# EAGLE design os20.newenc1 (EAGLE 6.3)
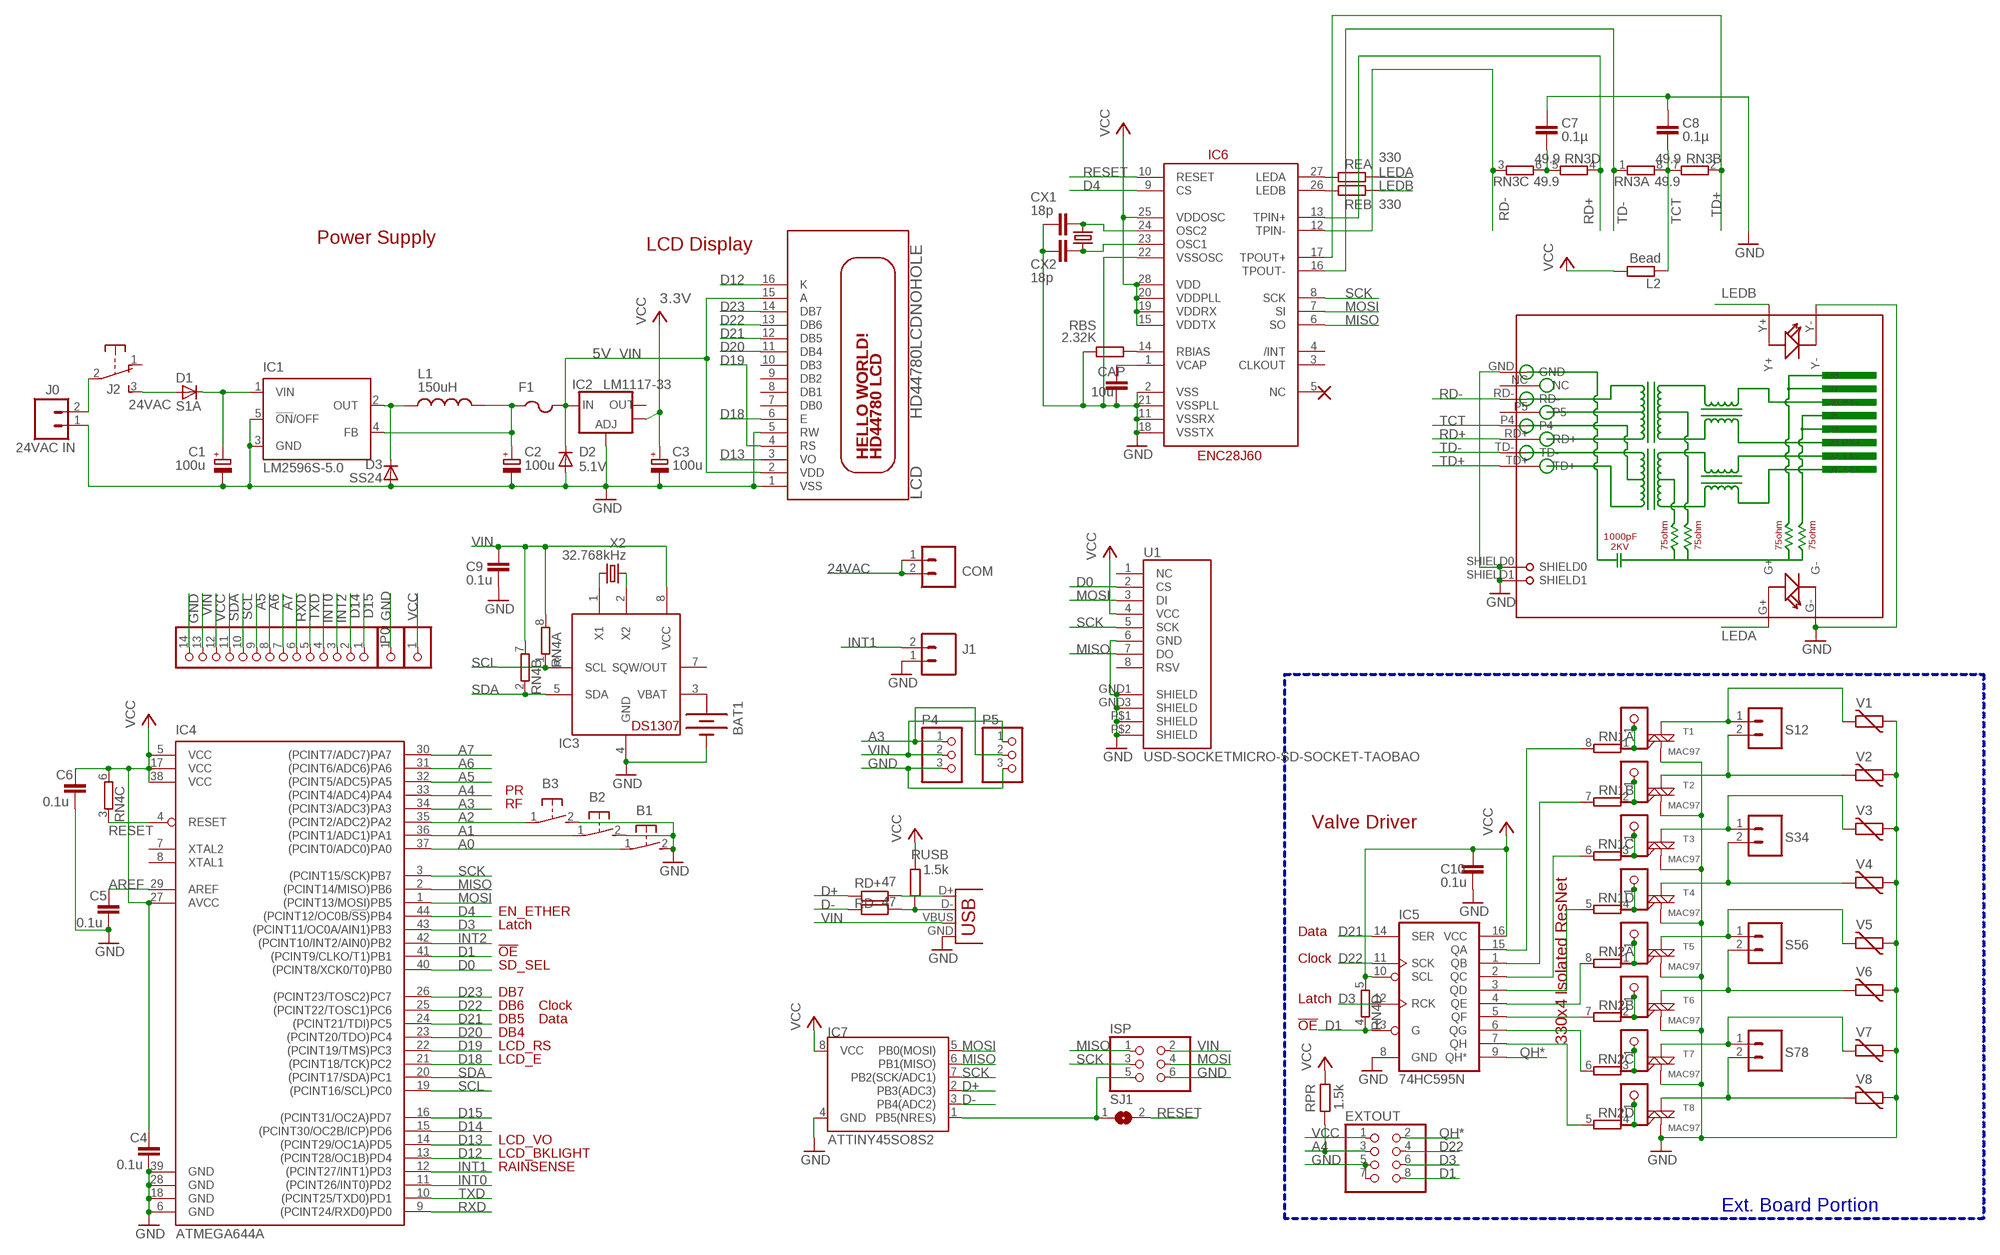
[diagram p0: schematic, sheet 1]

## Parts
B1  31-XX  [B3F-31XX]
B2  31-XX  [B3F-31XX]
B3  31-XX  [B3F-31XX]
BAT1  BATTERYBATTERY_12MM_SMT  [BATTCON_12MM_SMT]
C1  100u  CPOL-EUE3.5-8  [E3,5-8]
C2  100u  CPOL-EUD  [PANASONIC_D]
C3  100u  CPOL-EUD  [PANASONIC_D]
C4  0.1u  C-EUC0805  [C0805]
C5  0.1u  C-EUC0805  [C0805]
C6  0.1u  C-EUC0805  [C0805]
C7  0.1µ  C-EUC0805  [C0805]
C8  0.1µ  C-EUC0805  [C0805]
C9  0.1u  C-EUC0805  [C0805]
C10  0.1u  C-EUC0805  [C0805]
CAP  10u  C-EUC0805  [C0805]
COM  M025MM  [SCREWTERMINAL-5MM-2]
CX1  18p  C-EUC0805  [C0805]
CX2  18p  C-EUC0805  [C0805]
D1  S1A  DIODE-DO-214AC  [DO-214AC]
D2  5.1V  DIODE-MINIMELF  [MINIMELF]
D3  SS24  DIODE-DO-214AC  [DO-214AC]
EXTOUT  PINHD-2X4  [2X04]
F1  PTCFUSE-1812  [1812]
IC1  LM2596S-5.0  LM2596S  [TO263-5]
IC2  LM1117-33  V_REG_LM1117SOT223  [SOT223]
IC3  DS1307  DS1307SOIC  [SO08]
IC4  ATMEGA644A  [TQFP44]
IC5  74HC595N  74LS595D  [SO16]
IC6  ENC28J60  ENC28J60SO28LONG  [SOIC28WLONG]
IC7  ATTINY45SO8S2  [SO8S2]
ISP  PINHD-2X3  [2X03]
J0  24VAC IN  M025MM  [SCREWTERMINAL-5MM-2]
J1  M025MM  [SCREWTERMINAL-5MM-2]
J2  EG1206  [EG1206]
JP2  PINHD-1X1CB  [1X01-CLEANBIG]
JP3  PINHD-1X1CB  [1X01-CLEANBIG]
JP4  PINHD-1X1CB  [1X01-CLEANBIG]
JP5  PINHD-1X1CB  [1X01-CLEANBIG]
JP6  PINHD-1X1CB  [1X01-CLEANBIG]
JP7  PINHD-1X1CB  [1X01-CLEANBIG]
JP8  PINHD-1X1CB  [1X01-CLEANBIG]
JP9  PINHD-1X1CB  [1X01-CLEANBIG]
L1  150uH  INDUCTORPWR  [CDRH125]
L2  Bead  R-EU_R0805  [R0805]
LCD  HD44780LCDNOHOLE  [LCD1602A]
P0  PINHD-1X14-CB  [1X14-CB]
P1  PINHD-1X1CB  [1X01-CLEANBIG]
P2  PINHD-1X1CB  [1X01-CLEANBIG]
P4  PINHD-1X3  [1X03]
P5  PINHD-1X3  [1X03]
RBS  2.32K  R-EU_R0805  [R0805]
RD+  47  R-EU_R0805  [R0805]
RD-  47  R-EU_R0805  [R0805]
REA  330  R-EU_R0805  [R0805]
REB  330  R-EU_R0805  [R0805]
RJ45  HR911105A  [HR911105A]
RN1  4R-NEXB38V  [EXB38V]
RN2  4R-NEXB38V  [EXB38V]
RN3  49.9  4R-NEXB38V  [EXB38V]
RN4  4R-NEXB38V  [EXB38V]
RPR  1.5k  R-EU_R0805  [R0805]
RUSB  1.5k  R-EU_R0805  [R0805]
S12  M025MM  [SCREWTERMINAL-5MM-2]
S34  M025MM  [SCREWTERMINAL-5MM-2]
S56  M025MM  [SCREWTERMINAL-5MM-2]
S78  M025MM  [SCREWTERMINAL-5MM-2]
SJ1  SJ  [SJ]
T1  MAC97  MAC97SOT223  [SOT223]
T2  MAC97  MAC97SOT223  [SOT223]
T3  MAC97  MAC97SOT223  [SOT223]
T4  MAC97  MAC97SOT223  [SOT223]
T5  MAC97  MAC97SOT223  [SOT223]
T6  MAC97  MAC97SOT223  [SOT223]
T7  MAC97  MAC97SOT223  [SOT223]
T8  MAC97  MAC97SOT223  [SOT223]
U1  USD-SOCKETMICRO-SD-SOCKET-TAOBAO  [MICRO-SD-SOCKET-TAOBAO]
USB  USBPTH  [USB-B-PTH]
V1  MOV  VARISTOR-5  [R-5]
V2  MOV  VARISTOR-5  [R-5]
V3  MOV  VARISTOR-5  [R-5]
V4  MOV  VARISTOR-5  [R-5]
V5  MOV  VARISTOR-5  [R-5]
V6  MOV  VARISTOR-5  [R-5]
V7  MOV  VARISTOR-5  [R-5]
V8  MOV  VARISTOR-5  [R-5]
X1  25MHz  CRYSTALHC49US  [HC49US]
X2  32.768kHz  CRYSTALTC26H  [TC26H]

## Nets
24VAC [power]: COM.1 COM.2 D1.A J2.3(S)
A0: B1.1(P) IC4.37((PCINT0/ADC0)PA0)
A1: B2.1(P) IC4.36((PCINT1/ADC1)PA1)
A2: B3.1(P) IC4.35((PCINT2/ADC2)PA2)
A3: IC4.34((PCINT3/ADC3)PA3) P4.1 P5.2
A4: EXTOUT.3 IC4.33((PCINT4/ADC4)PA4) RPR.1
A5: IC4.32((PCINT5/ADC5)PA5) P0.9
A6: IC4.31((PCINT6/ADC6)PA6) P0.8
A7: IC4.30((PCINT7/ADC7)PA7) P0.7
AREF: C5.1 IC4.29(AREF)
D0: IC4.40((PCINT8/XCK0/T0)PB0) U1.2(CS)
D1: EXTOUT.8 IC4.41((PCINT9/CLKO/T1)PB1) IC5.13(G) RN4.4
D3: EXTOUT.6 IC4.43((PCINT11/OC0A/AIN1)PB3) IC5.12(RCK)
D4: IC4.44((PCINT12/OC0B/!SS!)PB4) IC6.9(CS)
D12: IC4.13((PCINT28/OC1B)PD4) LCD.16(K)
D13: IC4.14((PCINT29/OC1A)PD5) LCD.3(VO)
D14: IC4.15((PCINT30/OC2B/ICP)PD6) P0.2
D15: IC4.16((PCINT31/OC2A)PD7) P0.1
D18: IC4.21((PCINT18/TCK)PC2) LCD.6(E)
D19: IC4.22((PCINT19/TMS)PC3) LCD.4(RS)
D20: IC4.23((PCINT20/TDO)PC4) LCD.11(DB4)
D21: IC4.24((PCINT21/TDI)PC5) IC5.14(SER) LCD.12(DB5)
D22: EXTOUT.4 IC4.25((PCINT22/TOSC1)PC6) IC5.11(SCK) LCD.13(DB6)
D23: IC4.26((PCINT23/TOSC2)PC7) LCD.14(DB7)
D+: IC7.2(PB3(ADC3)) RD+.1
D-: IC7.3(PB4(ADC2)) RD-.1
GND: B1.2(S) B2.2(S) B3.2(S) BAT1.P$1(-) C1.- C2.- C3.- C4.2 C5.2 C6.2 C7.1 C8.1 C9.2 C10.2 CAP.2 CX1.2 CX2.2 D2.A D3.A EXTOUT.5 EXTOUT.7 IC1.3(GND) IC1.5(!ON!/OFF) IC2.1(ADJ) IC3.4(GND) IC4.6(GND) IC4.18(GND) IC4.28(GND) IC4.39(GND) IC5.8(GND) IC6.2(VSS) IC6.11(VSSRX) IC6.18(VSSTX) IC6.21(VSSPLL) IC6.22(VSSOSC) IC7.4(GND) ISP.6 J0.1 J1.1 LCD.1(VSS) LCD.5(RW) P0.14 P1.1 P4.3 P5.3 RBS.1 RJ45.G- RJ45.GND RJ45.SHIELD0 RJ45.SHIELD1 RJ45.Y- T1.1(M1) T2.1(M1) T3.1(M1) T4.1(M1) T5.1(M1) T6.1(M1) T7.1(M1) T8.1(M1) U1.6(GND) U1.GND1(SHIELD) U1.GND3(SHIELD) U1.P$1(SHIELD) U1.P$2(SHIELD) USB.GND V1.1 V2.1 V3.1 V4.1 V5.1 V6.1 V7.1 V8.1
INT0: IC4.11((PCINT26/INT0)PD2) P0.4
INT1: IC4.12((PCINT27/INT1)PD3) J1.2
INT2: IC4.42((PCINT10/INT2/AIN0)PB2) P0.3
LEDA: REA.2 RJ45.G+
LEDB: REB.2 RJ45.Y+
MISO: IC4.2((PCINT14/MISO)PB6) IC6.6(SO) IC7.6(PB1(MISO)) ISP.1 U1.7(DO)
MOSI: IC4.1((PCINT13/MOSI)PB5) IC6.7(SI) IC7.5(PB0(MOSI)) ISP.4 U1.3(DI)
N$1 [power]: C1.+ D1.C IC1.1(VIN)
N$2 [power]: C2.+ F1.1 IC1.4(FB) L1.2
N$3: JP2.1 RN1.1 T1.3(G)
N$4: IC5.5(QF) RN2.7
N$5: IC5.6(QG) RN2.6
N$6 [power]: J0.2 J2.2(P)
N$7: IC5.7(QH) RN2.5
N$8: IC3.1(X1) X2.2
N$9 [power]: D3.C IC1.2(OUT) L1.1
N$10: IC5.4(QE) RN2.8
N$11: IC5.3(QD) RN1.5
N$12: IC5.2(QC) RN1.6
N$13: IC5.1(QB) RN1.7
N$14: IC5.15(QA) RN1.8
N$15: JP3.1 RN1.2 T2.3(G)
N$16 [power]: S12.1 T1.4(M2) V1.2
N$17 [power]: S12.2 T2.4(M2) V2.2
N$18 [power]: S34.1 T3.4(M2) V3.2
N$19: JP4.1 RN1.3 T3.3(G)
N$20 [power]: S34.2 T4.4(M2) V4.2
N$21: JP5.1 RN1.4 T4.3(G)
N$22 [power]: S56.1 T5.4(M2) V5.2
N$23 [power]: S56.2 T6.4(M2) V6.2
N$24 [power]: S78.1 T7.4(M2) V7.2
N$25 [power]: S78.2 T8.4(M2) V8.2
N$26: JP6.1 RN2.1 T5.3(G)
N$27: JP7.1 RN2.2 T6.3(G)
N$28: JP8.1 RN2.3 T7.3(G)
N$29: JP9.1 RN2.4 T8.3(G)
N$30: IC3.2(X2) X2.1
N$34: IC6.27(LEDA) REA.1
N$36: BAT1.P$2(+) IC3.3(VBAT)
N$37: IC6.26(LEDB) REB.1
N$38: RD+.2 USB.D+
N$39: CAP.1 IC6.1(VCAP)
N$41: CX1.1 IC6.24(OSC2) X1.2
N$42: CX2.1 IC6.23(OSC1) X1.1
N$45: RD-.2 RUSB.1 USB.D-
N$52: IC7.1(PB5(NRES)) ISP.5 SJ1.1
N$54: C7.2 RN3.5 RN3.6
N$59: IC6.14(RBIAS) RBS.2
QH*: EXTOUT.2 IC5.9(QH*)
RD+: IC6.13(TPIN+) RJ45.RD+ RN3.4
RD-: IC6.12(TPIN-) RJ45.RD- RN3.3
RESET: IC4.4(RESET) IC6.10(RESET) RN4.3 SJ1.2
RXD: IC4.9((PCINT24/RXD0)PD0) P0.6
SCK: IC4.3((PCINT15/SCK)PB7) IC6.8(SCK) IC7.7(PB2(SCK/ADC1)) ISP.3 U1.5(SCK)
SCL: IC3.6(SCL) IC4.19((PCINT16/SCL)PC0) P0.10 RN4.1
SDA: IC3.5(SDA) IC4.20((PCINT17/SDA)PC1) P0.11 RN4.2
TCT: C8.2 L2.1 RJ45.P4 RN3.7 RN3.8
TD+: IC6.17(TPOUT+) RJ45.TD+ RN3.2
TD-: IC6.16(TPOUT-) RJ45.TD- RN3.1
TXD: IC4.10((PCINT25/TXD0)PD1) P0.5
VCC: C3.+ C4.1 C6.1 C10.1 EXTOUT.1 IC2.4(OUT) IC4.5(VCC) IC4.17(VCC) IC4.27(AVCC) IC4.38(VCC) IC5.10(SCL) IC5.16(VCC) IC6.15(VDDTX) IC6.19(VDDRX) IC6.20(VDDPLL) IC6.25(VDDOSC) IC6.28(VDD) IC7.8(VCC) L2.2 P0.12 P2.1 RN4.5 RN4.6 RPR.2 RUSB.2 U1.4(VCC)
VIN [power]: C9.1 D2.C F1.2 IC2.3(IN) IC3.8(VCC) ISP.2 LCD.2(VDD) LCD.15(A) P0.13 P4.2 P5.1 RN4.7 RN4.8 USB.VBUS
Unconnected: IC2.2(OUT) IC3.7(SQW/OUT) IC4.7(XTAL2) IC4.8(XTAL1) IC6.3(CLKOUT) IC6.4(/INT) IC6.5(NC) J2.1(O) LCD.7(DB0) LCD.8(DB1) LCD.9(DB2) LCD.10(DB3) RJ45.NC RJ45.P5 U1.1(NC) U1.8(RSV)

## Buses
B$1

## Notes on the sheet
- Power Supply
- LCD Display
- 3.3V
- 5V
- PR
- RF
- Valve Driver
- EN_ETHER
- Latch
- Data
- !OE
- Clock
- SD_SEL
- DB7
- Latch
- DB6 | Clock
- DB5 | Data
- !OE
- DB4
- 330x4 Isolated ResNet
- LCD_RS
- LCD_E
- LCD_VO
- LCD_BKLIGHT
- RAINSENSE
- Ext. Board Portion

## Library data of the parts
B1-B3 = adafruit:31-XX: OMRON SWITCH Now with beefier pads!
BAT1 = SparkFunNew:BATTERY: Battery Holders Various common sizes : AA, AAA, 20mm coin cell and 12mm coin cell.
C1-C3 = resistor:CPOL-EU: POLARIZED CAPACITOR, European symbol
C4-C6 C9 C10 = rcl:C-EU: CAPACITOR, European symbol
C7 C8 CAP CX1 CX2 = resistor:C-EU: CAPACITOR, European symbol
COM J0 J1 S12 S34 S56 S78 = SparkFun:M02: Header 2 Standard 2-pin 0.1" header. Use with straight break away headers (SKU : PRT-00116), right angle break away headers (PRT-00553), swiss pins (PRT-00743), machine pins (PRT-00117), and female headers (PRT-00115). Molex polarized connector foot print use with SKU : PRT-08233 with associated crimp pins and housings.
D1-D3 = diode:DIODE-: DIODE
EXTOUT = pinhead:PINHD-2X4: PIN HEADER
F1 = adafruit:PTCFUSE: PTC fuses, resettable thermistors
IC1 = national-semiconductor:LM2596: SIMPLE SWITCHER® Power Converter 150 kHz 3A Step-Down Voltage Regulator Source: http://www.national.com/ds/LM/LM2596.pdf; MF: NATIONAL SEMICONDUCTOR; MPN: LM2596S-ADJ/NOPB; OC_FARNELL: 9494367; OC_NEWARK: 41K3842
IC2 = SparkFun:V_REG_LM1117: Voltage Regulator LM1117 Standard adjustable voltage regulator but in SMD form. Spark Fun Electronics SKU : COM-00595
IC3 = adafruit:DS1307: DS1307 Real time clock (RTC) with battery backup ability. Talk to it via i2c
IC4 = atmel:ATMEGA644: 8-bit Microcontroller with 64K Bytes In-System Programmable Flash Source: http://www.atmel.com/dyn/resources/prod_documents/doc2593.pdf; MPN: ATMEGA644PV-10AU; OC_FARNELL: 1455123; OC_NEWARK: 58M3748
IC5 = SparkFun:74*595: 8-bit SHIFT REGISTER, output latch
IC6 = SparkFun:ENC28J60
IC7 = SparkFun:ATTINY45: Atmel ATTiny45
ISP = pinhead:PINHD-2X3: PIN HEADER
J2 = adafruit:EG1206
JP2-JP9 P1 P2 = adafruit:PINHD-1X1: Pin header 1x1 for 0.1" spacing With round pins
L1 = SparkFunNew:INDUCTOR: Inductors Basic Inductor/Choke - 0603 and 1206. Footprints are not proven and vary greatly between part numbers.
L2 RBS RD+ RD- REA REB RPR RUSB = rcl:R-EU_: RESISTOR, European symbol
LCD = adafruit:HD44780LCD: HD44780 LCD Standard character type LCDs, available in sizes from 8x1 to 40x4!
P0 = adafruit:PINHD-1X14: PIN HEADER
P4 P5 = pinhead:PINHD-1X3: PIN HEADER
RJ45 = CONNECTER:HR911105A
RN1-RN4 = resistor-dil:4R-N: Array Chip Resistor Source: RS Component / Phycomp; OC_FARNELL: unknown; OC_NEWARK: unknown
SJ1 = jumper:SJ: SMD solder JUMPER
T1-T8 = SparkFun:MAC97: MAC97 Triac http://www.onsemi.com/pub_link/Collateral/MAC97-D.PDF
U1 = SparkFunNew:USD-SOCKET: microSD Socket Push-push type uSD socket. Schematic element and footprint production proven. Spark Fun Electronics SKU : PRT-00127. tDoc lines correctly indicate media card edge positions when inserting (unlocked, locked, depressed).
USB = SparkFunNew:USB: USB Connectors USB-B-PTH is fully proven SKU : PRT-00139 USB-miniB is fully proven SKU : PRT-00587 USB-A-PCB is untested. USB-A-H is throughly reviewed, but untested. Spark Fun Electronics SKU : PRT-00437 USB-B-SMT is throughly reviewed, but untested. Needs silkscreen touching up. USB-A-S has not been used/tested USB-MB-H has not been used/tested
V1-V8 = varistor:VARISTOR: VARISTOR
X1 = SparkFun:CRYSTAL: Crystals Various standard crystals. Proven footprints. Spark Fun Electronics SKU : COM-00534
X2 = crystal:CRYSTAL: CRYSTAL; OC_FARNELL: unknown; OC_NEWARK: unknown

## Net classes
0 default: width 0.305 mm, clearance 0.203 mm
1 power: width 0.61 mm, clearance 0.203 mm

## Board
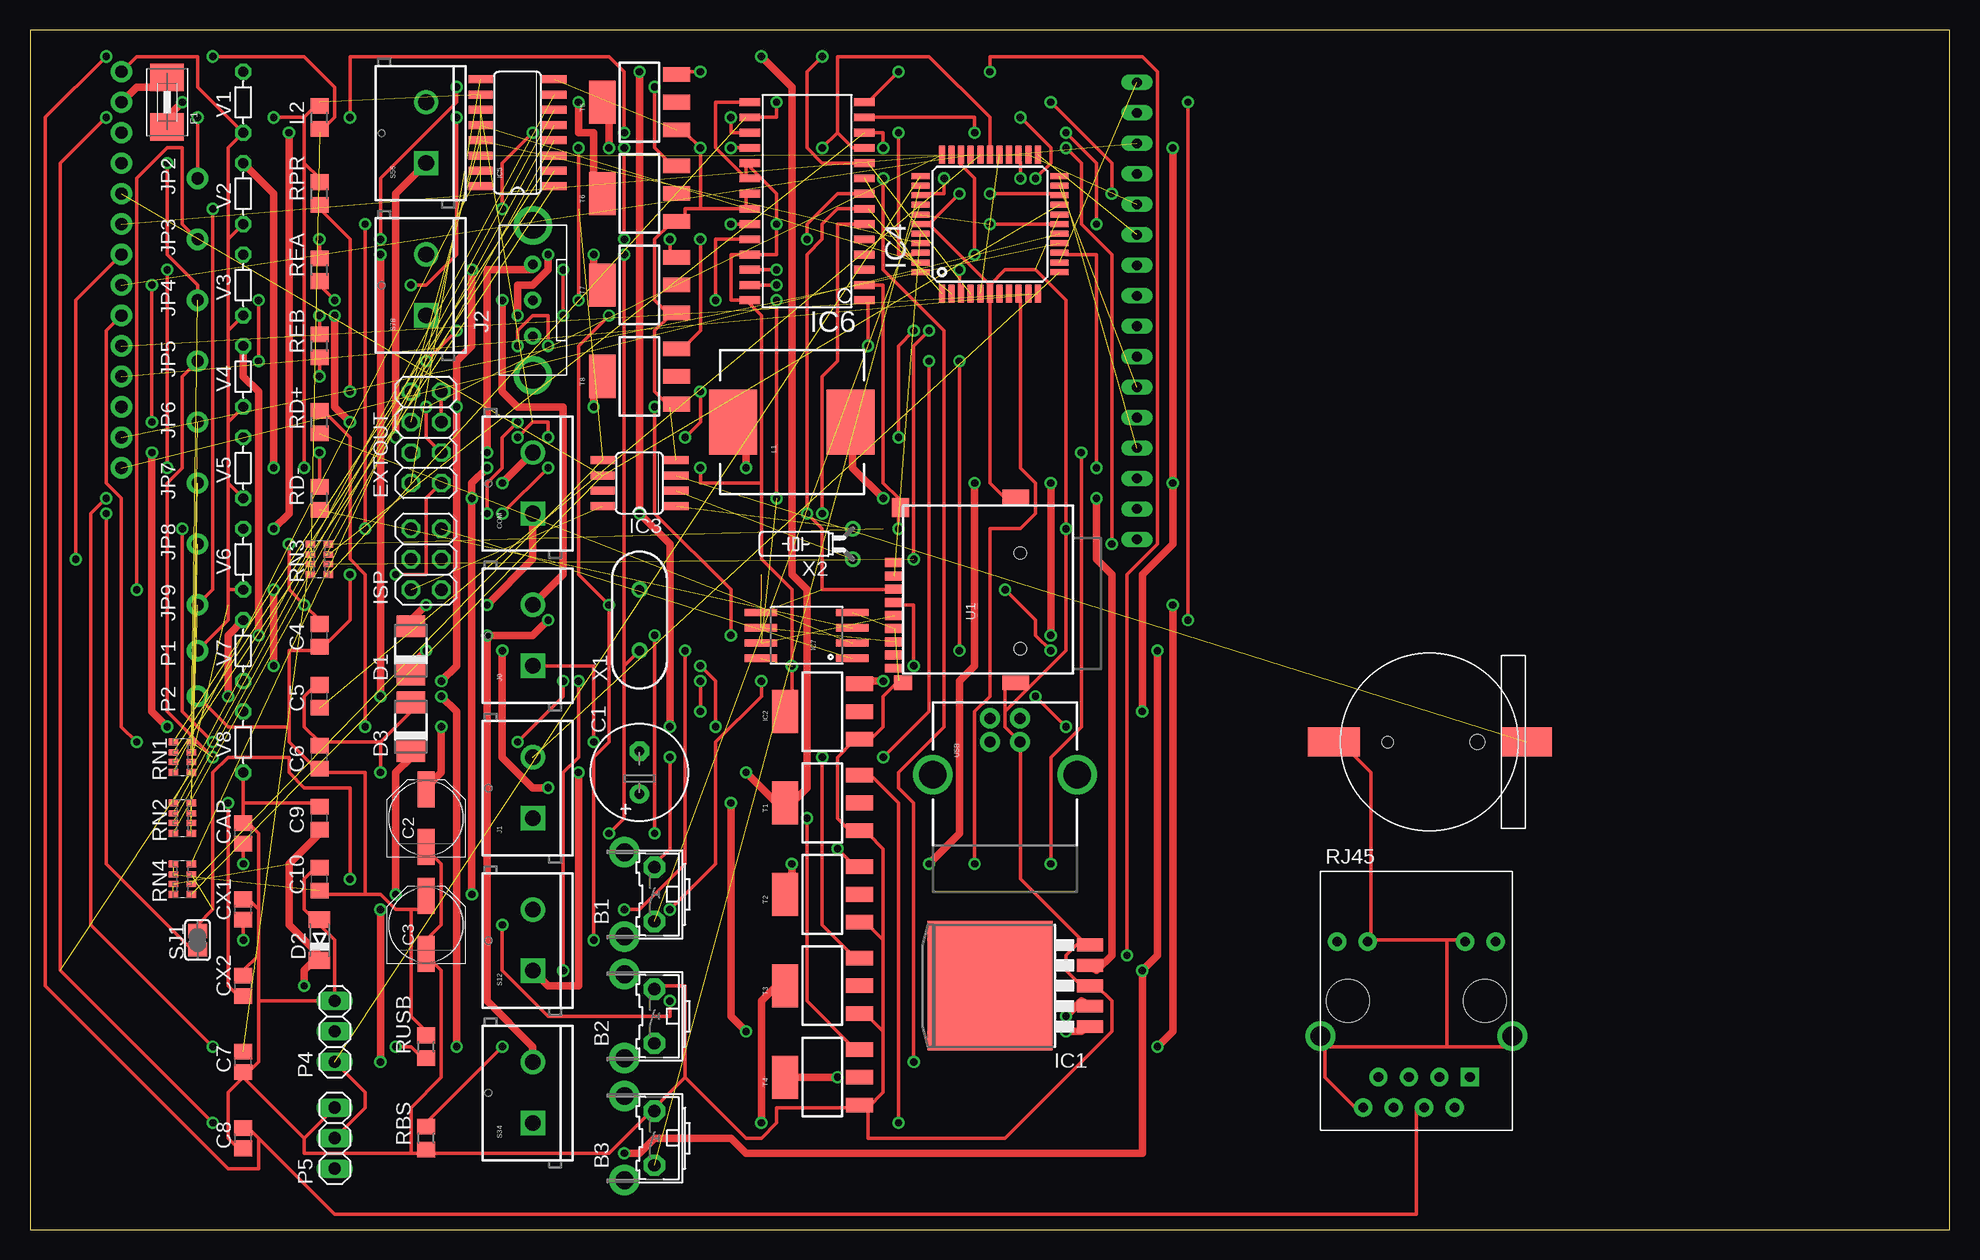
[diagram p1: board, top side]
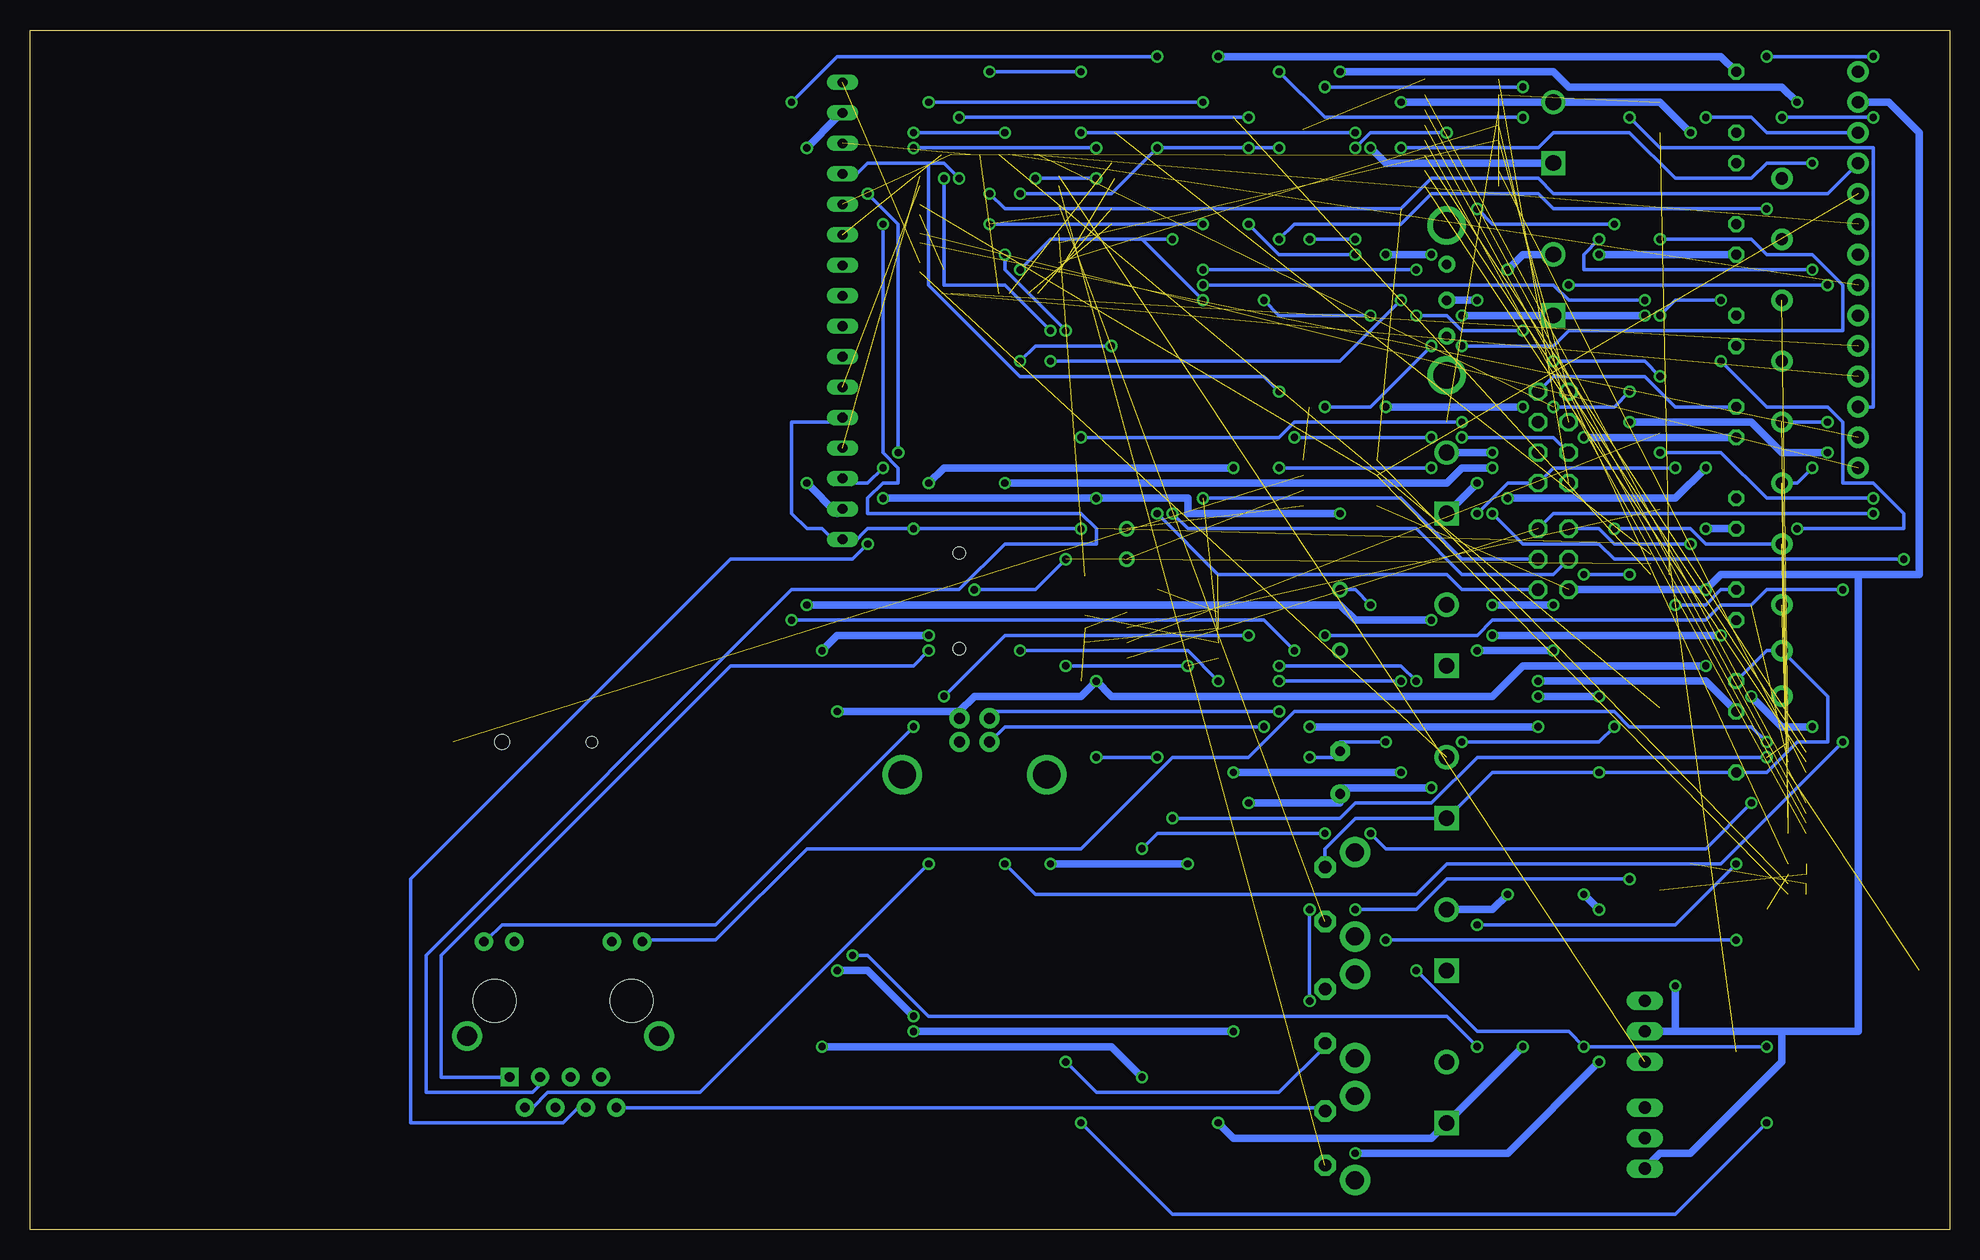
[diagram p2: board, bottom side, seen from below]

Size 160 x 100 mm. Coordinates in mm from the lower left corner, seen from the top.
Outline: 0,0 160,0 160,100 0,100 0,0
Copper layers (1*16): Top 0.035mm / dielectric 1.5mm / Bottom 0.035mm
Design rules "default": minimum track width 10mil, minimum drill 24mil, track to track 8mil, track to pad 8mil, pad to pad 8mil, via to via 8mil, smd to smd 8mil, copper to edge 40mil, drill to drill 8mil, minimum pad ring 10mil, minimum via ring 8mil, stop-mask expansion 4mil, vias tented up to drill 0mil, thermal gap 10mil

### Footprints (pad centres in the part's own frame; a part is rotated, then mirrored left to right if it is on the bottom)
B3F-31XX = drill 1.016 pad 1.778 octagon: 1 -2.261,-1.245; 2 2.261,-1.245 | drill 1.499 pad 2.54: 3 -3.505,1.245; 4 3.505,1.245
BATTCON_12MM_SMT = smd 2.4 x 4.3: P$1 0,11.96 | smd 2.4 x 4.2: P$2 0,-4.1 | hole 0.95: 0,7.5 | hole 1.25: 0,0
E3,5-8 = drill 0.813 pad 1.6: + -1.778,0 | drill 0.813 pad 1.6 octagon: - 1.778,0
PANASONIC_D = smd 3 x 1.4: + 2.4,0; - -2.4,0
C0805 = smd 1.3 x 1.5: 1 -0.95,0; 2 0.95,0
C0805' = smd 1.3 x 1.5: 1 -0.85,0; 2 0.85,0
SCREWTERMINAL-5MM-2 = drill 1.3 pad 2.032 square: 1 0,0 | drill 1.3 pad 2.032: 2 5.08,0
DO-214AC = smd 1.8 x 2.4: A 2.025,0; C -2.025,0
MINIMELF = smd 1.4 x 1.8: A 1.7,0; C -1.7,0
2X04 = drill 1.016 octagon: 1 -3.81,-1.27; 2 -3.81,1.27; 3 -1.27,-1.27; 4 -1.27,1.27; 5 1.27,-1.27; 6 1.27,1.27; 7 3.81,-1.27; 8 3.81,1.27
1812 = smd 2.286 x 2.794: 1 -2.046,0; 2 2.046,0
TO263-5 = smd 1.067 x 2.159: 1 -3.404,-5.791; 2 -1.702,-5.791; 3 0,-5.791; 4 1.702,-5.791; 5 3.404,-5.791 | smd 10.8 x 10.41: 6 0,2.54
SOT223 = smd 1.219 x 2.235: 1 -2.311,-3.099; 2 0,-3.099; 3 2.311,-3.099 | smd 3.6 x 2.2: 4 0,3.099
SO08 = smd 0.66 x 2.032: 1 -1.905,-3.073; 2 -0.635,-3.073; 3 0.635,-3.073; 4 1.905,-3.073; 5 1.905,3.073; 6 0.635,3.073; 7 -0.635,3.073; 8 -1.905,3.073
TQFP44 = smd 1.5 x 0.5: 1 -5.8,4; 2 -5.8,3.2; 3 -5.8,2.4; 4 -5.8,1.6; 5 -5.8,0.8; 6 -5.8,0; 7 -5.8,-0.8; 8 -5.8,-1.6; 9 -5.8,-2.4; 10 -5.8,-3.2; 11 -5.8,-4; 23 5.8,-4; 24 5.8,-3.2; 25 5.8,-2.4; 26 5.8,-1.6; 27 5.8,-0.8; 28 5.8,0; 29 5.8,0.8; 30 5.8,1.6; 31 5.8,2.4; 32 5.8,3.2; 33 5.8,4 | smd 0.5 x 1.5: 12 -4,-5.8; 13 -3.2,-5.8; 14 -2.4,-5.8; 15 -1.6,-5.8; 16 -0.8,-5.8; 17 0,-5.8; 18 0.8,-5.8; 19 1.6,-5.8; 20 2.4,-5.8; 21 3.2,-5.8; 22 4,-5.8; 34 4,5.8; 35 3.2,5.8; 36 2.4,5.8; 37 1.6,5.8; 38 0.8,5.8; 39 0,5.8; 40 -0.8,5.8; 41 -1.6,5.8; 42 -2.4,5.8; 43 -3.2,5.8; 44 -4,5.8
SO16 = smd 0.66 x 2.032: 1 -4.445,-3.073; 2 -3.175,-3.073; 3 -1.905,-3.073; 4 -0.635,-3.073; 5 0.635,-3.073; 6 1.905,-3.073; 7 3.175,-3.073; 8 4.445,-3.073; 9 4.445,3.073; 10 3.175,3.073; 11 1.905,3.073; 12 0.635,3.073; 13 -0.635,3.073; 14 -1.905,3.073; 15 -3.175,3.073; 16 -4.445,3.073
SOIC28WLONG = smd 0.65 x 1.7: 1 -8.89,-4.78; 2 -7.62,-4.78; 3 -6.35,-4.78; 4 -5.08,-4.78; 5 -3.81,-4.78; 6 -2.54,-4.78; 7 -1.27,-4.78; 8 0,-4.78; 9 1.27,-4.78; 10 2.54,-4.78; 11 3.81,-4.78; 12 5.08,-4.78; 13 6.35,-4.78; 14 7.62,-4.78; 15 7.62,4.78; 16 6.35,4.78; 17 5.08,4.78; 18 3.81,4.78; 19 2.54,4.78; 20 1.27,4.78; 21 0,4.78; 22 -1.27,4.78; 23 -2.54,4.78; 24 -3.81,4.78; 25 -5.08,4.78; 26 -6.35,4.78; 27 -7.62,4.78; 28 -8.89,4.78
SO8S2 = smd 0.61 x 2.7: 1 -1.905,-3.778; 2 -0.635,-3.778; 3 0.635,-3.778; 4 1.905,-3.778; 5 1.905,3.853; 6 0.635,3.853; 7 -0.635,3.853; 8 -1.905,3.853
2X03 = drill 1.016 octagon: 1 -2.54,-1.27; 2 -2.54,1.27; 3 0,-1.27; 4 0,1.27; 5 2.54,-1.27; 6 2.54,1.27
EG1206 = drill 0.8 pad 1.422: 1 -3,0; 2 0,0; 3 3,0 | drill 2.2: MT1 -6.25,0; MT2 6.25,0
1X01-CLEANBIG = drill 1.016 pad 1.778: 1 0,0
CDRH125 = smd 5.4 x 4: 1 0,4.9; 2 0,-4.9
R0805 = smd 1.3 x 1.5: 1 -0.95,0; 2 0.95,0
LCD1602A = drill 0.8 long: 1 8,33.46; 2 10.54,33.46; 3 13.08,33.46; 4 15.62,33.46; 5 18.16,33.46; 6 20.7,33.46; 7 23.24,33.46; 8 25.78,33.46; 9 28.32,33.46; 10 30.86,33.46; 11 33.4,33.46; 12 35.94,33.46; 13 38.48,33.46; 14 41.02,33.46; 15 43.56,33.46; 16 46.1,33.46
1X14-CB = drill 1.016 pad 1.778: 1 -16.51,0; 2 -13.97,0; 3 -11.43,0; 4 -8.89,0; 5 -6.35,0; 6 -3.81,0; 7 -1.27,0; 8 1.27,0; 9 3.81,0; 10 6.35,0; 11 8.89,0; 12 11.43,0; 13 13.97,0; 14 16.51,0
1X03 = drill 1.016 long: 1 -2.54,0; 2 0,0; 3 2.54,0
HR911105A = drill 0.813 pad 1.524: G+ 4.953,-6.604; G- 4.953,-4.064; GND -8.89,4.445; NC -6.35,3.175; P4 -8.89,-0.635; P5 -6.35,0.635; RD+ -6.35,-1.905; RD- -8.89,1.905; TD- -8.89,-3.175; Y+ 4.953,6.604; Y- 4.953,4.064 | drill 1.651 pad 2.159: SHIELD0 -2.921,8.001; SHIELD1 -2.921,-8.001 | drill 0.813 pad 1.524 square: TD+ -6.35,-4.445 | hole 3.556: 0,-5.715; 0,5.715
EXB38V = smd 0.6 x 0.8: 1 -1.275,-0.75; 4 1.275,-0.75; 5 1.275,0.75; 8 -1.275,0.75 | smd 0.5 x 0.8: 2 -0.4,-0.75; 3 0.4,-0.75; 6 0.4,0.75; 7 -0.4,0.75
SJ = smd 1.168 x 1.6: 1 -0.762,0; 2 0.762,0
MICRO-SD-SOCKET-TAOBAO = smd 0.75 x 1.6: 1 2.25,10.5; 2 1.15,10.5; 3 0.05,10.5; 4 -1.05,10.5; 5 -2.15,10.5; 6 -3.25,10.5; 7 -4.35,10.5; 8 -5.45,10.5 | smd 0.7 x 1.6: CD -6.55,10.5 | smd 1.2 x 1.5: GND1 -7.75,9.8 | smd 1.6 x 1.4: GND3 6.85,10 | smd 1.2 x 2.2: P$1 7.75,0.4; P$2 -7.75,0.4 | hole 1: 3.05,0; -4.93,0
USB-B-PTH = drill 0.914 pad 1.676: D+ 0,1.25; D- 1.981,1.25; GND 0,-1.25; VBUS 1.981,-1.25 | drill 2.286: S1 -2.718,-6.02; S2 -2.718,6.02
R-5 = drill 0.813 octagon: 1 -2.54,0; 2 2.54,0
HC49US = drill 0.813: 1 -2.54,0; 2 2.54,0
TC26H = drill 0.813: 1 -1.27,0; 2 1.27,0

### Placement (x,y rotation side)
B1  50.8,27.94 90 top
B2  50.8,17.78 90 top
B3  50.8,7.62 90 top
BAT1  120.65,40.64 90 top
C1  50.8,38.1 90 top
C2  33.02,34.29 90 top
C3  33.02,25.4 90 top
C4  24.13,49.53 90 top
C5  24.13,44.45 90 top
C6  24.13,39.37 90 top
C7  0.1µ  [C0805']  17.78,13.97 90 top
C8  0.1µ  [C0805']  17.78,7.62 90 top
C9  24.13,34.29 90 top
C10  24.13,29.21 90 top
CAP  10u  [C0805']  17.78,33.02 90 top
COM  41.91,59.69 90 top
CX1  18p  [C0805']  17.78,26.67 90 top
CX2  18p  [C0805']  17.78,20.32 90 top
D1  31.75,48.26 90 top
D2  24.13,24.13 90 top
D3  31.75,41.91 90 top
EXTOUT  33.02,66.04 90 top
F1  11.43,93.98 90 top
IC1  82.55,20.32 90 top
IC2  66.04,43.18 90 top
IC3  50.8,62.23 90 top
IC4  80.01,83.82 90 top
IC5  40.64,91.44 90 top
IC6  64.77,86.36 90 top
IC7  64.77,49.53 90 top
ISP  33.02,55.88 90 top
J0  41.91,46.99 90 top
J1  41.91,34.29 90 top
J2  41.91,77.47 90 top
JP2  13.97,87.63 90 top
JP3  13.97,82.55 90 top
JP4  13.97,77.47 90 top
JP5  13.97,72.39 90 top
JP6  13.97,67.31 90 top
JP7  13.97,62.23 90 top
JP8  13.97,57.15 90 top
JP9  13.97,52.07 90 top
L1  63.5,67.31 90 top
L2  24.13,92.71 90 top
LCD  125.73,49.53 90 top
P0  7.62,80.01 90 top
P1  13.97,48.26 90 top
P2  13.97,44.45 90 top
P4  25.4,16.51 90 top
P5  25.4,7.62 90 top
RBS  33.02,7.62 90 top
RD+  24.13,67.31 90 top
RD-  24.13,60.96 90 top
REA  24.13,80.01 90 top
REB  24.13,73.66 90 top
RJ45  115.57,19.05 90 top
RN1  12.7,39.37 90 top
RN2  12.7,34.29 90 top
RN3  24.13,55.88 90 top
RN4  12.7,29.21 90 top
RPR  24.13,86.36 90 top
RUSB  33.02,15.24 90 top
S12  41.91,21.59 90 top
S34  41.91,8.89 90 top
S56  33.02,88.9 90 top
S78  33.02,76.2 90 top
SJ1  13.97,24.13 90 top
T1  66.04,35.56 90 top
T2  66.04,27.94 90 top
T3  66.04,20.32 90 top
T4  66.04,12.7 90 top
T5  50.8,93.98 90 top
T6  50.8,86.36 90 top
T7  50.8,78.74 90 top
T8  50.8,71.12 90 top
U1  82.55,53.34 90 top
USB  81.28,40.64 90 top
V1  17.78,93.98 90 top
V2  17.78,86.36 90 top
V3  17.78,78.74 90 top
V4  17.78,71.12 90 top
V5  17.78,63.5 90 top
V6  17.78,55.88 90 top
V7  17.78,48.26 90 top
V8  17.78,40.64 90 top
X1  50.8,50.8 90 top
X2  68.58,57.15 90 top

### Tracks (layer width: path | path; a pad name or v marks a point on that pad's centre or on a via)
24VAC  (via drill 0.61)
  Top 0.61: v38.1,64.77 38.1,80.01 41.91,80.01 J2.3 | v33.02,52.07 31.75,50.8 D1.A | v38.1,52.07 41.91,55.88 COM.1 | v39.37,62.23 COM.2
  Bottom 0.61: COM.2 v38.1,64.77 | v38.1,52.07 v33.02,52.07 | COM.1 v39.37,62.23
A0  (1 unrouted)
A1  (via drill 0.61)
  Top 0.305: v76.2,87.63 76.2,86.36 74.93,86.36 IC4.36 | v71.12,87.63 71.12,80.01 76.2,74.93 76.2,41.91 72.39,38.1 72.39,36.83 73.66,35.56 v73.66,13.97
  Bottom 0.305: v71.12,87.63 v76.2,87.63 | v73.66,13.97 71.12,11.43 55.88,11.43 52.07,15.24 B2.1
A2  (1 unrouted)
A3  (1 unrouted)
  Top 0.305: P5.2 27.94,10.16 27.94,11.43 P4.1
A4  (via drill 0.61)  (1 unrouted)
  Top 0.305: v26.67,69.85 26.67,82.55 24.13,85.09 RPR.1 | v33.02,68.58 33.02,66.04 EXTOUT.3
  Bottom 0.305: v26.67,69.85 27.94,68.58 v33.02,68.58
A5  (1 unrouted)
A6  (via drill 0.61)
  Top 0.305: v78.74,81.28 78.74,87.63 77.47,88.9 IC4.31 | v73.66,74.93 72.39,73.66 v72.39,66.04 | v40.64,67.31 39.37,66.04 39.37,63.5 38.1,62.23 v38.1,59.69 | v3.81,55.88 3.81,77.47 P0.8
  Bottom 0.305: v78.74,81.28 78.74,80.01 v73.66,74.93 | v72.39,66.04 55.88,66.04 54.61,67.31 v40.64,67.31 | v38.1,59.69 35.56,57.15 29.21,57.15 27.94,55.88 v3.81,55.88
A7  (1 unrouted)
AREF  (1 unrouted)
D0  (1 unrouted)
D1  (3 unrouted)
D3  (2 unrouted)
D4  (1 unrouted)
D12  (1 unrouted)
D13  (via drill 0.61)
  Top 0.305: v88.9,63.5 88.9,81.28 86.36,81.28 IC4.14
  Bottom 0.305: v88.9,63.5 90.17,62.23 91.44,62.23 LCD.3
D14  (1 unrouted)
D15  (1 unrouted)
D18  (1 unrouted)
D19  (1 unrouted)
D20  (1 unrouted)
D21  (2 unrouted)
D22  (via drill 0.61)  (1 unrouted)
  Top 0.305: v82.55,87.63 82.55,88.9 IC4.25 | v40.64,66.04 41.91,67.31 43.18,67.31 v43.18,66.04 | v54.61,66.04 55.88,67.31 v55.88,69.85
  Bottom 0.305: v82.55,87.63 83.82,88.9 85.09,88.9 | 85.09,88.9 90.17,88.9 91.44,87.63 LCD.13 | EXTOUT.4 33.02,66.04 v40.64,66.04 | v54.61,66.04 v43.18,66.04 | v55.88,69.85 57.15,71.12 77.47,71.12 85.09,78.74 85.09,88.9
D23  (1 unrouted)
D+  (1 unrouted)
D-  (1 unrouted)
GND  (via drill 0.61)  (5 unrouted)
  Top 0.305: IC4.28 80.01,92.71 74.93,97.79 67.31,97.79 67.31,91.44 | 67.31,91.44 68.58,90.17 IC6.11 69.85,90.17 | 53.34,76.2 52.07,74.93 52.07,69.85 53.34,68.58 T8.1 | v58.42,90.17 IC6.18 | T5.1 54.61,91.44 v55.88,90.17 55.88,85.09 | 59.69,85.09 59.69,86.36 IC6.21 | 55.88,85.09 54.61,85.09 54.61,83.82 T6.1 53.34,83.82 52.07,82.55 52.07,77.47 53.34,76.2 | 55.88,85.09 59.69,85.09 | 59.69,85.09 IC6.22 | 53.34,76.2 T7.1 | v66.04,90.17 67.31,91.44 | IC6.2 71.12,78.74 71.12,62.23 72.39,60.96 U1.GND3 72.39,59.69 v72.39,58.42 | 74.93,83.82 80.01,78.74 | U1.P$1 81.28,60.96 80.01,62.23 IC4.6 80.01,78.74 | 87.63,24.13 86.36,22.86 86.36,21.59 87.63,20.32 IC1.3 88.9,20.32 90.17,19.05 90.17,16.51 81.28,7.62 69.85,7.62 69.85,10.16 | 81.28,43.18 81.28,41.91 82.55,40.64 | 81.28,43.18 81.28,45.72 U1.P$2 | 87.63,24.13 82.55,29.21 82.55,40.64 | 87.63,24.13 IC1.5 | 82.55,40.64 USB.GND | 80.01,78.74 81.28,80.01 83.82,80.01 86.36,77.47 v86.36,58.42 86.36,48.26 81.28,43.18 | 74.93,83.82 v77.47,86.36 | 74.93,83.82 IC4.39 | C4.2 24.13,50.8 v22.86,52.07 21.59,53.34 v21.59,57.15 | EXTOUT.7 EXTOUT.5 | 16.51,62.23 V5.1 | 16.51,67.31 16.51,62.23 | V4.1 16.51,67.31 | 16.51,74.93 V3.1 | 16.51,67.31 16.51,74.93 | 16.51,82.55 V2.1 | 16.51,74.93 16.51,82.55 | 16.51,82.55 16.51,90.17 V1.1 13.97,95.25 13.97,97.79 8.89,97.79 P0.14 | P1.1 16.51,50.8 16.51,53.34 | 16.51,62.23 16.51,53.34 | 16.51,53.34 V6.1 | v53.34,39.37 53.34,31.75 52.07,30.48 B1.2 | J0.1 46.99,46.99 v46.99,40.64 | 24.13,40.64 22.86,41.91 22.86,44.45 24.13,45.72 C5.2 | 29.21,40.64 31.75,43.18 D3.A | 24.13,40.64 29.21,40.64 | 24.13,40.64 C6.2 | V8.1 17.78,35.56 | 17.78,35.56 17.78,34.29 | 17.78,35.56 24.13,35.56 C9.2
  Top 0.305: v29.21,38.1 29.21,40.64 | 107.95,15.24 107.95,12.7 110.49,10.16 RJ45.GND | 118.11,24.13 119.38,24.13 RJ45.G- | 118.11,24.13 111.76,24.13 | 111.76,24.13 111.76,38.1 109.22,40.64 BAT1.P$1 | 111.76,24.13 RJ45.Y- | 118.11,15.24 123.19,15.24 RJ45.SHIELD1 | 118.11,24.13 118.11,15.24 | 118.11,15.24 107.95,15.24 | 107.95,15.24 RJ45.SHIELD0 | U1.GND1 72.39,45.72 71.12,44.45 71.12,41.91 69.85,40.64 IC2.1 68.58,40.64 67.31,39.37 67.31,34.29 68.58,33.02 T1.1 69.85,33.02 71.12,31.75 71.12,24.13 | 69.85,10.16 71.12,11.43 71.12,16.51 | 71.12,16.51 69.85,17.78 T3.1 | 71.12,24.13 69.85,25.4 T2.1 | 71.12,16.51 71.12,24.13 | 17.78,12.7 16.51,11.43 16.51,7.62 17.78,6.35 C8.1 | 24.13,25.4 22.86,26.67 22.86,29.21 24.13,30.48 C10.2 | 19.05,22.86 17.78,21.59 CX2.2 | 19.05,26.67 19.05,22.86 | 19.05,26.67 17.78,27.94 CX1.2 | 19.05,19.05 P4.3 25.4,24.13 24.13,25.4 | 19.05,22.86 19.05,19.05 | 24.13,25.4 D2.A | 17.78,12.7 19.05,13.97 19.05,19.05 | C2.- 33.02,31.75 34.29,30.48 34.29,25.4 33.02,24.13 C3.- 33.02,22.86 34.29,21.59 34.29,12.7 31.75,10.16 31.75,6.35 | 31.75,6.35 22.86,6.35 22.86,7.62 | 31.75,6.35 33.02,6.35 | P5.3 22.86,7.62 | 52.07,10.16 48.26,6.35 33.02,6.35 | 33.02,6.35 RBS.1 | 54.61,12.7 54.61,20.32 52.07,20.32 B2.2 | 52.07,10.16 54.61,12.7 | 52.07,10.16 B3.2 | 22.86,7.62 17.78,12.7 | 17.78,12.7 C7.1 | 54.61,12.7 59.69,7.62 60.96,7.62 62.23,8.89 62.23,10.16 68.58,10.16 T4.1 69.85,10.16 | 17.78,34.29 19.05,33.02 19.05,26.67 | 17.78,34.29 CAP.2
  Bottom 0.305: v55.88,90.17 v58.42,90.17 v66.04,90.17 69.85,86.36 v77.47,86.36 | LCD.5 92.71,67.31 96.52,67.31 96.52,59.69 95.25,58.42 93.98,58.42 92.71,57.15 LCD.1 91.44,57.15 90.17,58.42 v86.36,58.42 v72.39,58.42 | v22.86,52.07 20.32,52.07 19.05,53.34 V6.1 | ISP.6 29.21,58.42 27.94,57.15 v21.59,57.15 | V7.1 15.24,48.26 P1.1 10.16,44.45 10.16,40.64 12.7,40.64 15.24,38.1 V8.1 v29.21,38.1 38.1,38.1 J1.1 49.53,34.29 52.07,31.75 52.07,30.48 B1.2 | EXTOUT.7 33.02,71.12 25.4,71.12 22.86,68.58 V4.1 | v53.34,39.37 50.8,39.37 C1.- 50.8,40.64 v46.99,40.64 | RJ45.GND 52.07,10.16 B3.2
INT0  (1 unrouted)
INT1  (1 unrouted)
INT2  (via drill 0.61)
  Top 0.305: v72.39,91.44 72.39,81.28 73.66,81.28 IC4.42 | v49.53,91.44 49.53,96.52 48.26,97.79 26.67,97.79 v26.67,92.71
  Bottom 0.305: v49.53,91.44 v72.39,91.44 | v26.67,92.71 24.13,90.17 6.35,90.17 6.35,68.58 P0.3
LEDA  (via drill 0.61)
  Top 0.305: v24.13,82.55 REA.2 | v40.64,73.66 40.64,74.93 41.91,76.2 43.18,76.2 v43.18,73.66 | v52.07,68.58 52.07,59.69 58.42,53.34 v58.42,49.53 | v86.36,41.91 v83.82,44.45
  Bottom 0.305: v24.13,82.55 16.51,82.55 15.24,81.28 11.43,81.28 8.89,78.74 8.89,74.93 31.75,74.93 33.02,73.66 v40.64,73.66 | v43.18,73.66 48.26,68.58 v52.07,68.58 | v58.42,49.53 78.74,49.53 v83.82,44.45 | v86.36,41.91 102.87,25.4 120.65,25.4 121.92,24.13 RJ45.G+
LEDB  (via drill 0.61)
  Top 0.305: v24.13,76.2 REB.2 | v19.05,72.39 v19.05,77.47 | v12.7,58.42 12.7,43.18 v15.24,40.64
  Bottom 0.305: v24.13,76.2 22.86,77.47 v19.05,77.47 | v19.05,72.39 15.24,68.58 10.16,68.58 8.89,67.31 8.89,62.23 6.35,62.23 3.81,59.69 3.81,58.42 v12.7,58.42 | v15.24,40.64 16.51,41.91 26.67,41.91 27.94,43.18 54.61,43.18 58.42,39.37 64.77,39.37 72.39,31.75 95.25,31.75 102.87,24.13 109.22,24.13 RJ45.Y+
MISO  (via drill 0.61)  (3 unrouted)
  Top 0.305: v66.04,59.69 66.04,71.12 67.31,72.39 67.31,83.82 IC6.6 69.85,83.82
  Bottom 0.305: v66.04,59.69 60.96,54.61 41.91,54.61 40.64,53.34 ISP.1
MOSI  (via drill 0.61)  (2 unrouted)
  Top 0.305: U1.3 72.39,53.34 66.04,53.34 66.04,58.42 v64.77,59.69 64.77,81.28 66.04,82.55 66.04,83.82 67.31,85.09 IC6.7 69.85,85.09
  Bottom 0.305: ISP.4 33.02,54.61 40.64,54.61 44.45,58.42 63.5,58.42 v64.77,59.69
N$1  (via drill 0.61)
  Top 0.61: v86.36,16.51 87.63,16.51 IC1.1 | v59.69,16.51 58.42,17.78 v58.42,35.56 | v33.02,48.26 31.75,46.99 D1.C | v39.37,48.26 39.37,39.37 41.91,36.83 v43.18,36.83
  Bottom 0.61: v59.69,16.51 v86.36,16.51 | v58.42,35.56 50.8,35.56 C1.+ 50.8,36.83 v43.18,36.83 | v39.37,48.26 v33.02,48.26
N$2  (via drill 0.61)
  Top 0.61: v88.9,60.96 88.9,55.88 90.17,54.61 90.17,22.86 88.9,21.59 IC1.4 | v71.12,60.96 68.58,63.5 68.58,67.31 L1.2 | v12.7,93.98 11.43,92.71 F1.1 | v50.8,96.52 v50.8,59.69 53.34,57.15 v53.34,41.91 | v34.29,41.91 34.29,38.1 33.02,36.83 C2.+
  Bottom 0.61: v88.9,60.96 v71.12,60.96 63.5,60.96 63.5,59.69 v50.8,59.69 | v12.7,93.98 13.97,95.25 31.75,95.25 33.02,96.52 v50.8,96.52 | v53.34,41.91 v34.29,41.91
N$3  (via drill 0.61)  (1 unrouted)
  Top 0.305: v72.39,8.89 72.39,35.56 69.85,38.1 T1.3 | v15.24,8.89 2.54,21.59 2.54,88.9 v6.35,92.71 | JP2.1 v13.97,92.71
  Bottom 0.305: v72.39,8.89 64.77,1.27 22.86,1.27 v15.24,8.89 | v13.97,92.71 v6.35,92.71
N$4  (1 unrouted)
N$5  (1 unrouted)
N$6  (via drill 0.61)
  Top 0.61: v39.37,77.47 39.37,69.85 40.64,68.58 44.45,68.58 44.45,54.61 J0.2
  Bottom 0.61: v39.37,77.47 J2.2
N$7  (1 unrouted)
N$8  (1 unrouted)
N$9  (via drill 0.61)
  Top 0.61: v86.36,17.78 87.63,19.05 IC1.2 | v93.98,48.26 93.98,22.86 v92.71,21.59 92.71,6.35 59.69,6.35 58.42,7.62 52.07,7.62 50.8,6.35 v49.53,6.35 | v85.09,62.23 v85.09,49.53 | v59.69,63.5 59.69,67.31 L1.1 | v30.48,27.94 30.48,38.1 31.75,39.37 D3.C | v29.21,13.97 v29.21,26.67
  Bottom 0.61: v86.36,17.78 90.17,21.59 v92.71,21.59 | v93.98,48.26 92.71,49.53 v85.09,49.53 | v85.09,62.23 83.82,63.5 v59.69,63.5 | v29.21,26.67 v30.48,27.94 | v29.21,13.97 36.83,6.35 v49.53,6.35
N$10  (1 unrouted)
N$11  (1 unrouted)
N$12  (1 unrouted)
N$13  (1 unrouted)
N$14  (1 unrouted)
N$15  (via drill 0.61)  (1 unrouted)
  Top 0.305: v67.31,31.75 68.58,30.48 T2.3 | v52.07,49.53 v52.07,33.02 | v8.89,53.34 8.89,87.63 11.43,90.17 12.7,90.17 12.7,83.82 JP3.1
  Bottom 0.305: v67.31,31.75 66.04,33.02 v52.07,33.02 | v52.07,49.53 39.37,49.53 38.1,50.8 20.32,50.8 19.05,52.07 16.51,52.07 15.24,53.34 v8.89,53.34
N$16  (via drill 0.61)
  Top 0.61: v60.96,97.79 63.5,95.25 63.5,54.61 64.77,53.34 64.77,36.83 63.5,35.56 T1.4 62.23,35.56 v59.69,38.1 | S12.1 43.18,20.32 45.72,20.32 v45.72,38.1
  Bottom 0.61: V1.2 19.05,97.79 v60.96,97.79 | v59.69,38.1 v45.72,38.1
N$17  (via drill 0.61)
  Top 0.61: V2.2 20.32,86.36 v20.32,63.5 | v36.83,27.94 v36.83,60.96 36.83,62.23 v38.1,63.5 | v63.5,30.48 63.5,27.94 T2.4 | v74.93,30.48 77.47,33.02 77.47,45.72 78.74,46.99 v78.74,62.23
  Bottom 0.61: v20.32,63.5 22.86,60.96 v36.83,60.96 | v36.83,27.94 38.1,26.67 S12.2 | v74.93,30.48 v63.5,30.48 | v78.74,62.23 41.91,62.23 40.64,63.5 v38.1,63.5
N$18  (via drill 0.61)
  Top 0.61: v29.21,44.45 v29.21,81.28 | v34.29,44.45 35.56,43.18 v35.56,15.24 | v60.96,8.89 60.96,19.05 62.23,20.32 T3.4
  Bottom 0.61: v29.21,81.28 V3.2 | v34.29,44.45 v29.21,44.45 | v35.56,15.24 S34.1 43.18,7.62 59.69,7.62 v60.96,8.89
N$19  (via drill 0.61)  (1 unrouted)
  Top 0.305: v66.04,39.37 66.04,25.4 68.58,22.86 T3.3 | v71.12,39.37 74.93,43.18 v74.93,72.39 | v45.72,90.17 v45.72,77.47 | v11.43,88.9 11.43,81.28 13.97,78.74 JP4.1
  Bottom 0.305: v71.12,39.37 v66.04,39.37 | v74.93,72.39 50.8,72.39 v45.72,77.47 | v45.72,90.17 34.29,90.17 33.02,91.44 26.67,91.44 22.86,87.63 16.51,87.63 15.24,88.9 v11.43,88.9
N$20  (via drill 0.61)
  Top 0.61: V4.2 17.78,71.12 19.05,69.85 v19.05,49.53 | S34.2 41.91,15.24 38.1,19.05 v38.1,49.53 41.91,49.53 v43.18,50.8 | v67.31,12.7 T4.4 | v93.98,15.24 95.25,16.51 v95.25,52.07
  Bottom 0.61: v38.1,49.53 v19.05,49.53 | v67.31,12.7 69.85,15.24 v93.98,15.24 | v95.25,52.07 50.8,52.07 49.53,50.8 v43.18,50.8
N$21  (via drill 0.61)  (1 unrouted)
  Top 0.305: v64.77,34.29 64.77,19.05 68.58,15.24 T4.3 | v15.24,39.37 11.43,43.18 11.43,62.23 12.7,63.5 12.7,71.12 JP5.1
  Bottom 0.305: v64.77,34.29 50.8,34.29 49.53,35.56 43.18,35.56 39.37,39.37 v15.24,39.37
N$22  (via drill 0.61)
  Top 0.61: v30.48,66.04 30.48,86.36 S56.1 | v48.26,90.17 48.26,93.98 T5.4
  Bottom 0.61: v30.48,66.04 V5.2 | v48.26,90.17 46.99,88.9 S56.1
N$23  (via drill 0.61)
  Top 0.61: v20.32,58.42 21.59,59.69 v21.59,91.44 | v45.72,93.98 45.72,91.44 46.99,91.44 46.99,86.36 T6.4
  Bottom 0.61: v20.32,58.42 V6.2 | v21.59,91.44 24.13,93.98 S56.2 v45.72,93.98
N$24  (via drill 0.61)
  Top 0.61: V7.2 16.51,49.53 v16.51,44.45 | v11.43,41.91 10.16,43.18 v10.16,64.77 | v26.67,67.31 25.4,68.58 v25.4,76.2 | v46.99,81.28 46.99,78.74 T7.4 | v43.18,81.28 43.18,80.01 41.91,78.74 40.64,78.74 v40.64,76.2
  Bottom 0.61: v16.51,44.45 13.97,41.91 v11.43,41.91 | v10.16,64.77 13.97,64.77 16.51,67.31 v26.67,67.31 | v25.4,76.2 S78.1 v40.64,76.2 | v43.18,81.28 v46.99,81.28
N$25  (via drill 0.61)
  Top 0.61: v34.29,45.72 35.56,46.99 v35.56,68.58 35.56,72.39 36.83,73.66 v36.83,80.01 | v46.99,68.58 46.99,71.12 T8.4
  Bottom 0.61: V8.2 20.32,45.72 v34.29,45.72 | v36.83,80.01 35.56,81.28 S78.2 | v35.56,68.58 v46.99,68.58
N$26  (via drill 0.61)  (1 unrouted)
  Top 0.305: v55.88,96.52 54.61,96.52 T5.3 | v35.56,92.71 35.56,81.28 33.02,78.74 v31.75,78.74 | v10.16,67.31 v10.16,78.74
  Bottom 0.305: v55.88,96.52 52.07,92.71 v35.56,92.71 | v10.16,78.74 v31.75,78.74 | JP6.1 v10.16,67.31
N$27  (via drill 0.61)  (1 unrouted)
  Top 0.305: v52.07,95.25 52.07,90.17 53.34,88.9 T6.3 | v35.56,95.25 35.56,93.98 29.21,87.63 v29.21,82.55 | v11.43,63.5 v11.43,80.01
  Bottom 0.305: v35.56,95.25 v52.07,95.25 | v29.21,82.55 30.48,81.28 30.48,80.01 v11.43,80.01 | v11.43,63.5 12.7,62.23 JP7.1
N$28  (via drill 0.61)  (1 unrouted)
  Top 0.305: v53.34,82.55 53.34,81.28 T7.3 | v49.53,90.17 v49.53,82.55 | v41.91,91.44 39.37,88.9 v39.37,85.09 | v27.94,58.42 v27.94,83.82
  Bottom 0.305: v49.53,82.55 v53.34,82.55 | v49.53,90.17 48.26,91.44 v41.91,91.44 | v39.37,85.09 38.1,83.82 v27.94,83.82 | v27.94,58.42 21.59,58.42 20.32,57.15 JP8.1
N$29  (via drill 0.61)  (1 unrouted)
  Top 0.305: v55.88,82.55 55.88,74.93 54.61,73.66 T8.3 | v15.24,85.09 15.24,53.34 JP9.1
  Bottom 0.305: v55.88,82.55 54.61,83.82 45.72,83.82 43.18,86.36 34.29,86.36 33.02,85.09 v15.24,85.09
N$30  (1 unrouted)
N$34  (via drill 0.61)
  Top 0.305: v25.4,77.47 24.13,78.74 REA.1 | v62.23,78.74 IC6.27 59.69,78.74
  Bottom 0.305: v25.4,77.47 31.75,77.47 33.02,78.74 v62.23,78.74
N$36  (1 unrouted)
N$37  (via drill 0.61)
  Top 0.305: v24.13,71.12 REB.1 | v35.56,74.93 v33.02,72.39 | v44.45,80.01 v44.45,76.2 | v62.23,80.01 IC6.26 59.69,80.01
  Bottom 0.305: v24.13,71.12 25.4,72.39 v33.02,72.39 | v35.56,74.93 40.64,74.93 41.91,76.2 v44.45,76.2 | v62.23,80.01 v44.45,80.01
N$38  (via drill 0.61)
  Top 0.305: v27.94,41.91 27.94,54.61 26.67,55.88 26.67,66.04 24.13,68.58 RD+.2 | v40.64,40.64 44.45,44.45 v44.45,45.72 | v55.88,46.99 57.15,45.72 v57.15,41.91
  Bottom 0.305: v27.94,41.91 29.21,40.64 v40.64,40.64 | v44.45,45.72 45.72,46.99 v55.88,46.99 | v57.15,41.91 78.74,41.91 80.01,40.64 USB.D+
N$39  (via drill 0.61)
  Top 0.305: v17.78,30.48 CAP.1 | v39.37,25.4 39.37,21.59 43.18,17.78 53.34,17.78 v53.34,19.05 | v53.34,26.67 57.15,30.48 57.15,40.64 60.96,44.45 v60.96,45.72 | v77.47,72.39 v77.47,48.26 | v69.85,73.66 69.85,77.47 IC6.1
  Bottom 0.305: v17.78,30.48 22.86,25.4 v39.37,25.4 | v53.34,26.67 v53.34,19.05 | v60.96,45.72 63.5,48.26 v77.47,48.26 | v77.47,72.39 76.2,73.66 v69.85,73.66
N$41  (via drill 0.61)
  Top 0.305: v17.78,24.13 CX1.1 | v46.99,24.13 46.99,39.37 48.26,40.64 v48.26,52.07 45.72,54.61 45.72,73.66 v48.26,76.2 | IC6.24 57.15,82.55 v57.15,77.47
  Bottom 0.305: v46.99,24.13 v17.78,24.13 | v48.26,52.07 49.53,53.34 X1.2 | v57.15,77.47 55.88,76.2 v48.26,76.2
N$42  (via drill 0.61)
  Top 0.305: v16.51,35.56 16.51,20.32 17.78,19.05 CX2.1 | v48.26,33.02 49.53,34.29 49.53,46.99 | X1.1 49.53,46.99 | v58.42,83.82 IC6.23 | 49.53,46.99 v49.53,81.28
  Bottom 0.305: v16.51,35.56 20.32,31.75 46.99,31.75 v48.26,33.02 | v58.42,83.82 55.88,81.28 v49.53,81.28
N$45  (via drill 0.61)
  Top 0.305: v24.13,64.77 RD-.2 | v6.35,60.96 5.08,59.69 5.08,25.4 v15.24,15.24 | v30.48,15.24 31.75,15.24 33.02,13.97 RUSB.1 | v55.88,45.72 v55.88,43.18 | v45.72,45.72 45.72,39.37 44.45,38.1 v44.45,21.59
  Bottom 0.305: v24.13,64.77 19.05,64.77 15.24,60.96 v6.35,60.96 | v15.24,15.24 v30.48,15.24 31.75,16.51 39.37,16.51 v44.45,21.59 | v55.88,43.18 80.01,43.18 USB.D- | v45.72,45.72 v55.88,45.72
N$52  (via drill 0.61)  (1 unrouted)
  Top 0.305: v6.35,59.69 6.35,30.48 13.97,22.86 SJ1.1
  Bottom 0.305: v6.35,59.69 33.02,59.69 ISP.5
N$54  (2 unrouted)
N$59  (via drill 0.61)
  Top 0.305: v39.37,15.24 33.02,8.89 RBS.2 | v91.44,22.86 91.44,54.61 93.98,57.15 93.98,96.52 92.71,97.79 80.01,97.79 v80.01,96.52 | v72.39,96.52 69.85,93.98 IC6.14
  Bottom 0.305: v39.37,15.24 41.91,17.78 85.09,17.78 90.17,22.86 v91.44,22.86 | v72.39,96.52 v80.01,96.52
QH*  (1 unrouted)
RD+  (via drill 0.61)  (1 unrouted)
  Top 0.305: IC6.13 78.74,92.71 v78.74,91.44 | v86.36,91.44 88.9,88.9 v88.9,83.82
  Bottom 0.305: v86.36,91.44 v78.74,91.44 | v88.9,83.82 88.9,64.77 87.63,63.5 87.63,62.23 88.9,62.23 90.17,60.96 90.17,59.69 72.39,59.69 71.12,58.42 71.12,57.15 78.74,57.15 82.55,53.34 96.52,53.34 127,22.86 127,11.43 118.11,11.43 116.84,12.7 RJ45.RD+
RD-  (via drill 0.61)  (1 unrouted)
  Top 0.305: IC6.12 71.12,91.44 v71.12,90.17 | v86.36,90.17 87.63,88.9 87.63,83.82 90.17,81.28 v90.17,57.15
  Bottom 0.305: v86.36,90.17 v71.12,90.17 | v90.17,57.15 91.44,55.88 101.6,55.88 128.27,29.21 128.27,8.89 115.57,8.89 114.3,10.16 RJ45.RD-
RESET  (via drill 0.61)  (2 unrouted)
  Top 0.305: v26.67,29.21 26.67,36.83 22.86,36.83 21.59,38.1 21.59,39.37 16.51,39.37 15.24,38.1 15.24,26.67 13.97,25.4 SJ1.2 | v49.53,26.67 50.8,26.67 54.61,30.48 v54.61,48.26 | v96.52,93.98 v96.52,50.8 | v66.04,97.79 64.77,96.52 64.77,90.17 66.04,88.9 IC6.10 69.85,88.9
  Bottom 0.305: v26.67,29.21 41.91,29.21 44.45,26.67 v49.53,26.67 | v54.61,48.26 57.15,50.8 v96.52,50.8 | v96.52,93.98 92.71,97.79 v66.04,97.79
RXD  (via drill 0.61)
  Top 0.305: v78.74,30.48 78.74,43.18 80.01,44.45 80.01,58.42 82.55,58.42 83.82,59.69 83.82,62.23 82.55,63.5 82.55,77.47 IC4.9 | v8.89,40.64 7.62,41.91 7.62,60.96 6.35,62.23 6.35,74.93 P0.6
  Bottom 0.305: v78.74,30.48 76.2,27.94 44.45,27.94 41.91,30.48 19.05,30.48 v8.89,40.64
SCK  (via drill 0.61)  (2 unrouted)
  Top 0.305: v77.47,80.01 77.47,78.74 IC4.3 | v64.77,82.55 64.77,83.82 67.31,86.36 IC6.8 69.85,86.36 | v62.23,77.47 v62.23,60.96
  Bottom 0.305: v77.47,80.01 74.93,82.55 67.31,82.55 | v64.77,82.55 67.31,82.55 | ISP.3 40.64,55.88 45.72,60.96 v62.23,60.96 | 67.31,82.55 v62.23,77.47
SCL  (3 unrouted)
SDA  (via drill 0.61)  (2 unrouted)
  Top 0.305: v80.01,86.36 85.09,86.36 IC4.20
  Bottom 0.305: v80.01,86.36 78.74,85.09 45.72,85.09 43.18,87.63 34.29,87.63 33.02,86.36 10.16,86.36 P0.11
TCT  (via drill 0.61)  (2 unrouted)
  Top 0.305: 19.05,7.62 25.4,1.27 115.57,1.27 115.57,10.16 RJ45.P4 | 19.05,7.62 17.78,8.89 C8.2 | v15.24,97.79 22.86,97.79 25.4,95.25 25.4,92.71 24.13,91.44 L2.1 | v6.35,97.79 1.27,92.71 1.27,20.32 16.51,5.08 19.05,5.08 19.05,7.62
  Bottom 0.305: v6.35,97.79 v15.24,97.79
TD+  (via drill 0.61)  (1 unrouted)
  Top 0.305: IC6.17 58.42,91.44 v58.42,92.71 | v82.55,92.71 85.09,90.17 85.09,88.9 v83.82,87.63 | v74.93,74.93 73.66,73.66 v73.66,55.88 | v81.28,53.34 83.82,50.8 83.82,49.53 v85.09,48.26
  Bottom 0.305: v82.55,92.71 v58.42,92.71 | v83.82,87.63 83.82,78.74 78.74,78.74 v74.93,74.93 | v73.66,55.88 76.2,53.34 v81.28,53.34 | v85.09,48.26 86.36,46.99 101.6,46.99 125.73,22.86 125.73,12.7 RJ45.TD+
TD-  (via drill 0.61)  (1 unrouted)
  Top 0.305: v62.23,93.98 62.23,92.71 IC6.16 59.69,92.71 | v85.09,93.98 90.17,88.9 v90.17,86.36 | v87.63,64.77 87.63,41.91 85.09,39.37 v85.09,30.48
  Bottom 0.305: v85.09,93.98 v62.23,93.98 | v90.17,86.36 87.63,83.82 v87.63,64.77 | v85.09,30.48 104.14,11.43 116.84,11.43 118.11,10.16 RJ45.TD-
TXD  (1 unrouted)
VCC  (via drill 0.61)  (8 unrouted)
  Top 0.305: v73.66,46.99 73.66,52.07 72.39,52.07 U1.4 | IC2.4 63.5,43.18 v63.5,46.99 63.5,53.34 60.96,55.88 60.96,62.23 | 59.69,77.47 58.42,77.47 58.42,81.28 59.69,81.28 IC6.25 62.23,81.28 v62.23,83.82 62.23,86.36 59.69,88.9 | v80.01,83.82 IC4.17 | 59.69,88.9 59.69,87.63 | 59.69,88.9 IC6.19 | IC6.15 57.15,93.98 57.15,90.17 59.69,87.63 | 59.69,87.63 IC6.20 | 60.96,62.23 60.96,76.2 59.69,77.47 | 59.69,77.47 IC6.28 | 27.94,27.94 29.21,27.94 30.48,26.67 31.75,26.67 | 27.94,27.94 24.13,27.94 C10.1 | 31.75,26.67 33.02,26.67 C3.+ | 24.13,38.1 27.94,38.1 27.94,27.94 | 24.13,48.26 21.59,48.26 21.59,41.91 | 21.59,41.91 21.59,40.64 24.13,38.1 | 24.13,38.1 C6.1 | 31.75,26.67 31.75,17.78 33.02,16.51 RUSB.2 | P2.1 16.51,41.91 21.59,41.91 | 22.86,88.9 24.13,87.63 RPR.2 | 22.86,92.71 22.86,88.9 | 22.86,92.71 24.13,93.98 L2.2 | 22.86,88.9 v22.86,63.5 | 22.86,92.71 v20.32,92.71 | 24.13,48.26 26.67,50.8 v26.67,54.61 | v30.48,54.61 33.02,54.61 33.02,60.96 EXTOUT.1 | 24.13,48.26 C4.1 | 60.96,62.23 55.88,62.23 v55.88,63.5 | v39.37,59.69 v43.18,63.5
  Bottom 0.305: v63.5,46.99 v73.66,46.99 | v62.23,83.82 v80.01,83.82 | v22.86,63.5 33.02,63.5 EXTOUT.1 36.83,62.23 v39.37,59.69 | P0.12 15.24,91.44 16.51,92.71 v20.32,92.71 | v30.48,54.61 v26.67,54.61 | v43.18,63.5 v55.88,63.5
VIN  (via drill 0.61)  (3 unrouted)
  Top 0.61: v71.12,45.72 69.85,45.72 IC2.3 | v95.25,90.17 v95.25,62.23 95.25,57.15 92.71,54.61 v92.71,43.18 | 24.13,22.86 21.59,25.4 21.59,30.48 24.13,33.02 C9.1 | P0.13 8.89,95.25 11.43,95.25 F1.2 | 24.13,22.86 22.86,21.59 v22.86,20.32 | 24.13,22.86 D2.C | v20.32,53.34 v20.32,46.99
  Bottom 0.61: 82.55,43.18 81.28,44.45 72.39,44.45 v71.12,45.72 69.85,44.45 38.1,44.45 35.56,46.99 v20.32,46.99 | v95.25,62.23 92.71,59.69 LCD.2 | v95.25,90.17 92.71,92.71 LCD.15 | v92.71,43.18 82.55,43.18 | 82.55,43.18 USB.VBUS | P5.1 24.13,6.35 21.59,6.35 13.97,13.97 13.97,16.51 | P4.2 22.86,16.51 | 22.86,16.51 13.97,16.51 | ISP.2 v20.32,53.34 19.05,54.61 7.62,54.61 | 7.62,54.61 7.62,16.51 13.97,16.51 | P0.13 5.08,93.98 2.54,91.44 2.54,54.61 7.62,54.61 | 22.86,16.51 v22.86,20.32